# Altium schematic sheet main.SchDoc
size A4; SheetNumber: 1; SheetTotal: 6
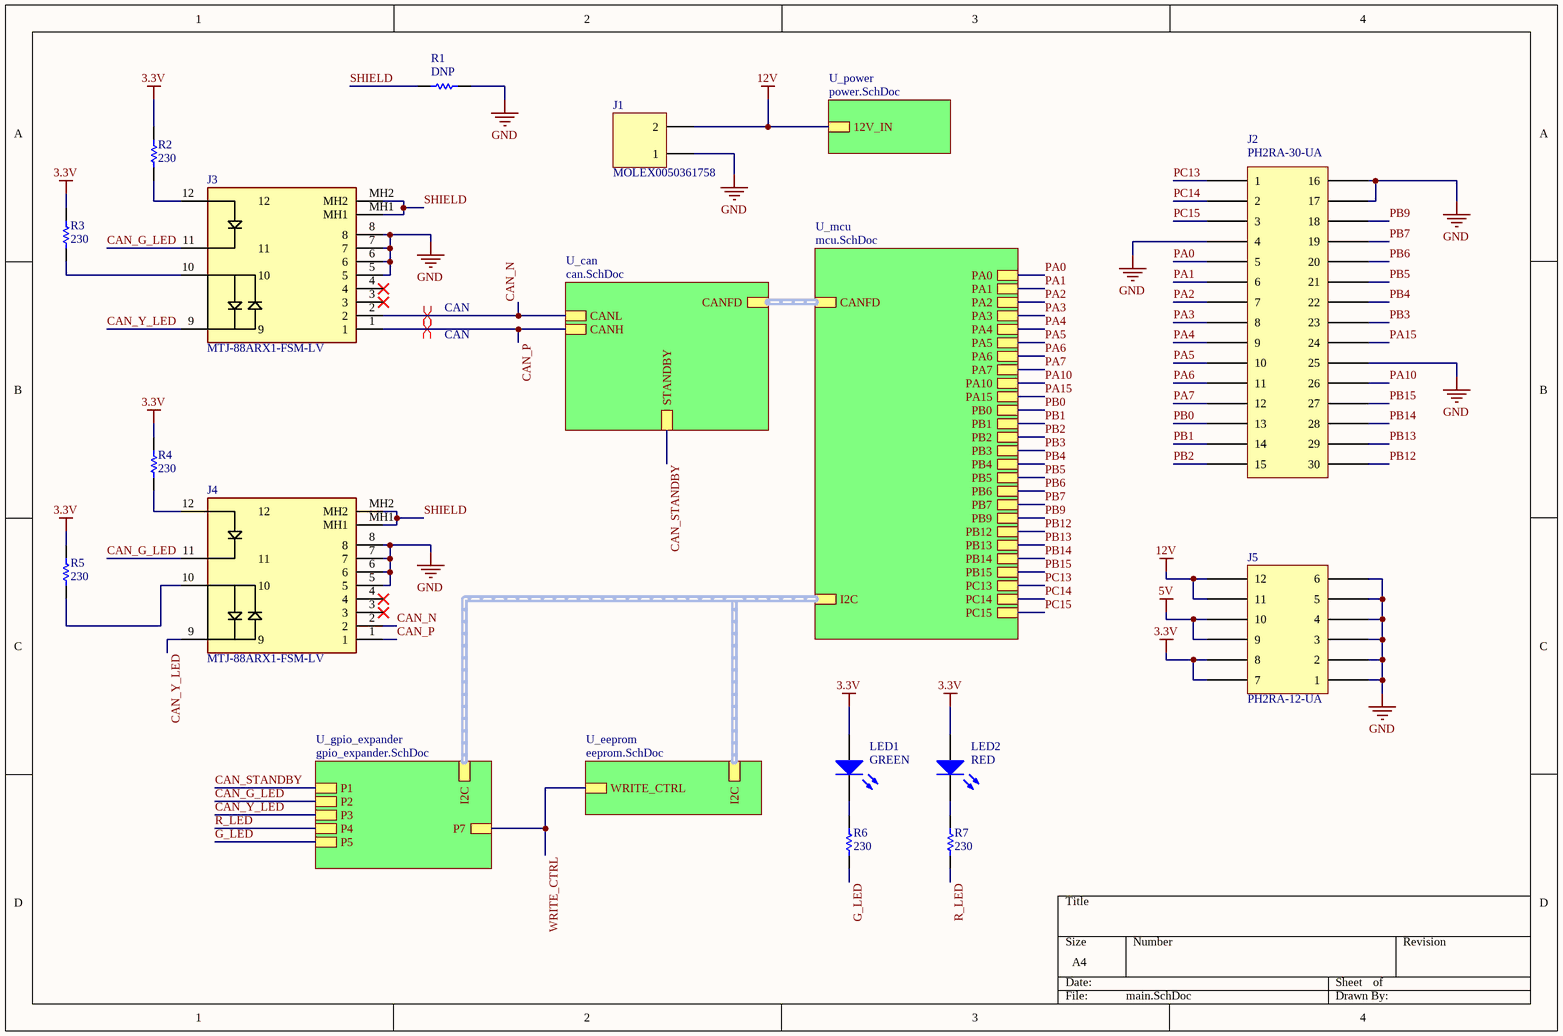
[diagram p0: main.SchDoc]

## Parts
J1  MOLEX0050361758  [Molex0050361758]
J2  PH2RA-30-UA  [PH2RA-30-UA]
J3  MTJ-88ARX1-FSM-LV  [MTJ-88ARX1-FSM-LV]
J4  MTJ-88ARX1-FSM-LV  [MTJ-88ARX1-FSM-LV]
J5  PH2RA-12-UA  [PH2RA-12-UA]
LED1  GREEN  [0805 - DIODE]
LED2  RED  [0805 - DIODE]
R1  value DNP  [0603 - Resistor]  (hidden comment: Resistor)
R2  value 230  [0603 - Resistor]  (hidden comment: Resistor)
R3  value 230  [0603 - Resistor]  (hidden comment: Resistor)
R4  value 230  [0603 - Resistor]  (hidden comment: Resistor)
R5  value 230  [0603 - Resistor]  (hidden comment: Resistor)
R6  value 230  [0603 - Resistor]  (hidden comment: Resistor)
R7  value 230  [0603 - Resistor]  (hidden comment: Resistor)

## Sub-sheets
U_can = can.SchDoc: CANFD (harness CANFD), STANDBY, CANL, CANH
U_eeprom = eeprom.SchDoc: I2C (harness I2C), WRITE_CTRL
U_gpio_expander = gpio_expander.SchDoc: I2C (harness I2C), P7, P1, P2, P3, P5, P4
U_mcu = mcu.SchDoc: CANFD (harness CANFD), I2C (harness I2C), PA0, PA1, PA2, PA3, PA4, PA5, PA6, PA7, PA10, PA15, PB0, PB1, PB2, PB3, PB4, PB5, PB6, PB7, PB9, PB12, PB13, PB14, PB15, PC13, PC14, PC15
U_power = power.SchDoc: 12V_IN

## Nets
3.3V: J5.7 J5.8 LED1.1(A) LED2.1(A) R2.1 R3.1 R4.1 R5.1
5V: J5.9 J5.10
12V: J1.2 J5.11 J5.12 ; sheet U_power/12V_IN
GND: J1.1 J2.4 J2.16 J2.17 J2.25 J3.5 J3.6 J3.7 J3.8 J4.5 J4.6 J4.7 J4.8 J5.1 J5.2 J5.3 J5.4 J5.5 J5.6 R1.1
CAN_G_LED: J3.11 J4.11 ; sheet U_gpio_expander/P2
CAN_N: J3.2 J4.2 ; sheet U_can/CANL
CAN_P: J3.1 J4.1 ; sheet U_can/CANH
CAN_STANDBY: sheet U_can/STANDBY, sheet U_gpio_expander/P1
CAN_Y_LED: J3.9 J4.9 ; sheet U_gpio_expander/P3
G_LED: R6.2 ; sheet U_gpio_expander/P5
PA0: J2.5 ; sheet U_mcu/PA0
PA1: J2.6 ; sheet U_mcu/PA1
PA2: J2.7 ; sheet U_mcu/PA2
PA3: J2.8 ; sheet U_mcu/PA3
PA4: J2.9 ; sheet U_mcu/PA4
PA5: J2.10 ; sheet U_mcu/PA5
PA6: J2.11 ; sheet U_mcu/PA6
PA7: J2.12 ; sheet U_mcu/PA7
PA10: J2.26 ; sheet U_mcu/PA10
PA15: J2.24 ; sheet U_mcu/PA15
PB0: J2.13 ; sheet U_mcu/PB0
PB1: J2.14 ; sheet U_mcu/PB1
PB2: J2.15 ; sheet U_mcu/PB2
PB3: J2.23 ; sheet U_mcu/PB3
PB4: J2.22 ; sheet U_mcu/PB4
PB5: J2.21 ; sheet U_mcu/PB5
PB6: J2.20 ; sheet U_mcu/PB6
PB7: J2.19 ; sheet U_mcu/PB7
PB9: J2.18 ; sheet U_mcu/PB9
PB12: J2.30 ; sheet U_mcu/PB12
PB13: J2.29 ; sheet U_mcu/PB13
PB14: J2.28 ; sheet U_mcu/PB14
PB15: J2.27 ; sheet U_mcu/PB15
PC13: J2.1 ; sheet U_mcu/PC13
PC14: J2.2 ; sheet U_mcu/PC14
PC15: J2.3 ; sheet U_mcu/PC15
R_LED: R7.2 ; sheet U_gpio_expander/P4
SHIELD: J3.MH1 J3.MH2 J4.MH1 J4.MH2 R1.2
WRITE_CTRL: sheet U_eeprom/WRITE_CTRL, sheet U_gpio_expander/P7
NetJ3_10: J3.10 R3.2
NetJ3_12: J3.12 R2.2
NetJ4_10: J4.10 R5.2
NetJ4_12: J4.12 R4.2
NetLED1_2: LED1.2(K) R6.1
NetLED2_2: LED2.2(K) R7.1

Not connected (* = marked no-connect by the designer): J3 3* 4*; J4 3* 4*

## Buses and harness runs
harness sheet U_can/CANFD = sheet U_mcu/CANFD
harness sheet U_eeprom/I2C = sheet U_gpio_expander/I2C = sheet U_mcu/I2C

## Layout directives
differential pair; differential pair class CAN: CAN_N, CAN_P

## Library data of the parts
J1 = MOLEX0050361758: Connector Header Through Hole, Right Angle 2 position -; Manufacturer: Molex; Manufacturer Part Number: 0050361758; Supplier: DigiKey; ComponentLink1Description: Datasheet; ComponentLink1URL: https://www.molex.com/pdm_docs/ps/PS-5556-001.pdf; Supplier Part Number: 0050361758-ND
J2 = PH2RA-30-UA: Connector Header Through Hole, Right Angle 30 position 0.100" (2.54mm); Manufacturer: Adam Tech; Manufacturer Part Number: PH2RA-30-UA; Supplier: DigiKey; Supplier Part Number: 2057-PH2RA-30-UA-ND; ComponentLink1Description: Datasheet; ComponentLink1URL: https://app.adam-tech.com/products/download/data_sheet/200508/ph2ra-xx-ua-data-sheet.pdf
J3 J4 = MTJ-88ARX1-FSM-LV: RJ45 Connector
J5 = PH2RA-12-UA: Connector Header Through Hole, Right Angle 12 position 0.100" (2.54mm); Manufacturer: Adam Tech; Manufacturer Part Number: PH2RA-30-UA; Supplier: DigiKey; Supplier Part Number: 2057-PH2RA-30-UA-ND; ComponentLink1Description: Datasheet; ComponentLink1URL: https://app.adam-tech.com/products/download/data_sheet/200508/ph2ra-xx-ua-data-sheet.pdf
LED1 LED2 = LED: Light Emitting Diode; Value: *; Manufacturer Part Number: *; Manufacturer: *; Supplier Part Number: *; Rating: *; Supplier: *
R1-R7 = Resistor: Rating: *; Manufacturer Part Number: *; Manufacturer: *; Supplier Part Number: *; Supplier: *